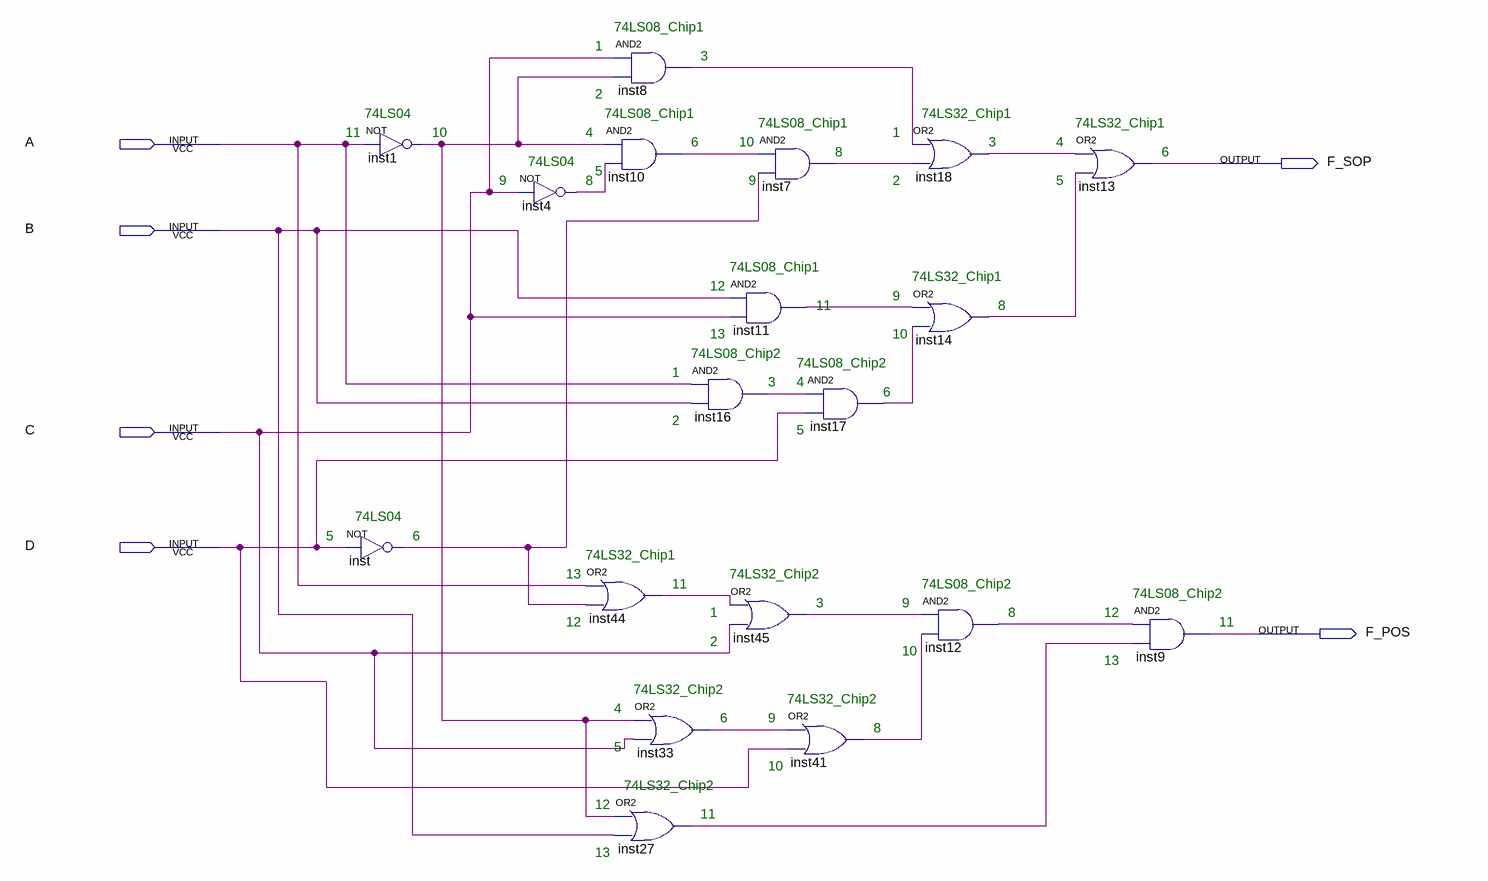
[diagram p0: schematic sheet]
// Quartus schematic Ex5.bdf as structural Verilog: 19 symbols, 6 pins
module Ex5 (
  input  A,
  input  B,
  input  C,
  input  D,
  output F_SOP,
  output F_POS
);

  wire inst1_out, inst4_out, inst7_out, inst8_out, inst10_out, inst11_out, inst12_out, inst14_out,
       inst16_out, inst17_out, inst18_out, inst27_out, inst33_out, inst41_out, inst44_out, inst45_out,
       inst_out;

  not inst (inst_out, D);
  not inst1 (inst1_out, A);
  not inst4 (inst4_out, C);
  and inst8 (inst8_out, C, inst1_out);
  and inst10 (inst10_out, inst1_out, inst4_out);
  or inst44 (inst44_out, A, inst_out);
  or inst33 (inst33_out, inst1_out, C);
  or inst27 (inst27_out, inst1_out, B);
  and inst11 (inst11_out, B, C);
  and inst16 (inst16_out, A, B);
  or inst45 (inst45_out, inst44_out, C);
  and inst7 (inst7_out, inst10_out, inst_out);
  and inst17 (inst17_out, inst16_out, D);
  or inst41 (inst41_out, inst33_out, D);
  or inst18 (inst18_out, inst8_out, inst7_out);
  or inst14 (inst14_out, inst11_out, inst17_out);
  and inst12 (inst12_out, inst45_out, inst41_out);
  or inst13 (F_SOP, inst18_out, inst14_out);
  and inst9 (F_POS, inst12_out, inst27_out);

  // Notes on the sheet:
  //   74LS08_Chip1
  //   1
  //   3
  //   2
  //   74LS04
  //   74LS08_Chip1
  //   74LS32_Chip1
  //   74LS08_Chip1
  //   74LS32_Chip1
  //   11
  //   10
  //   4
  //   1
  //   6
  //   10
  //   3
  //   4
  //   8
  //   6
  //   74LS04
  //   5
  //   9
  //   8
  //   9
  //   2
  //   5
  //   74LS08_Chip1
  //   74LS32_Chip1
  //   12
  //   9
  //   11
  //   8
  //   13
  //   10
  //   74LS08_Chip2
  //   74LS08_Chip2
  //   1
  //   3
  //   4
  //   6
  //   2
  //   5
  //   74LS04
  //   5
  //   6
  //   74LS32_Chip1
  //   13
  //   74LS32_Chip2
  //   11
  //   74LS08_Chip2
  //   74LS08_Chip2
  //   3
  //   9
  //   1
  //   8
  //   12
  //   12
  //   11
  //   2
  //   10
  //   13
  //   74LS32_Chip2
  //   74LS32_Chip2
  //   4
  //   6
  //   9
  //   8
  //   5
  //   10
  //   74LS32_Chip2
  //   12
  //   11
  //   13
endmodule
